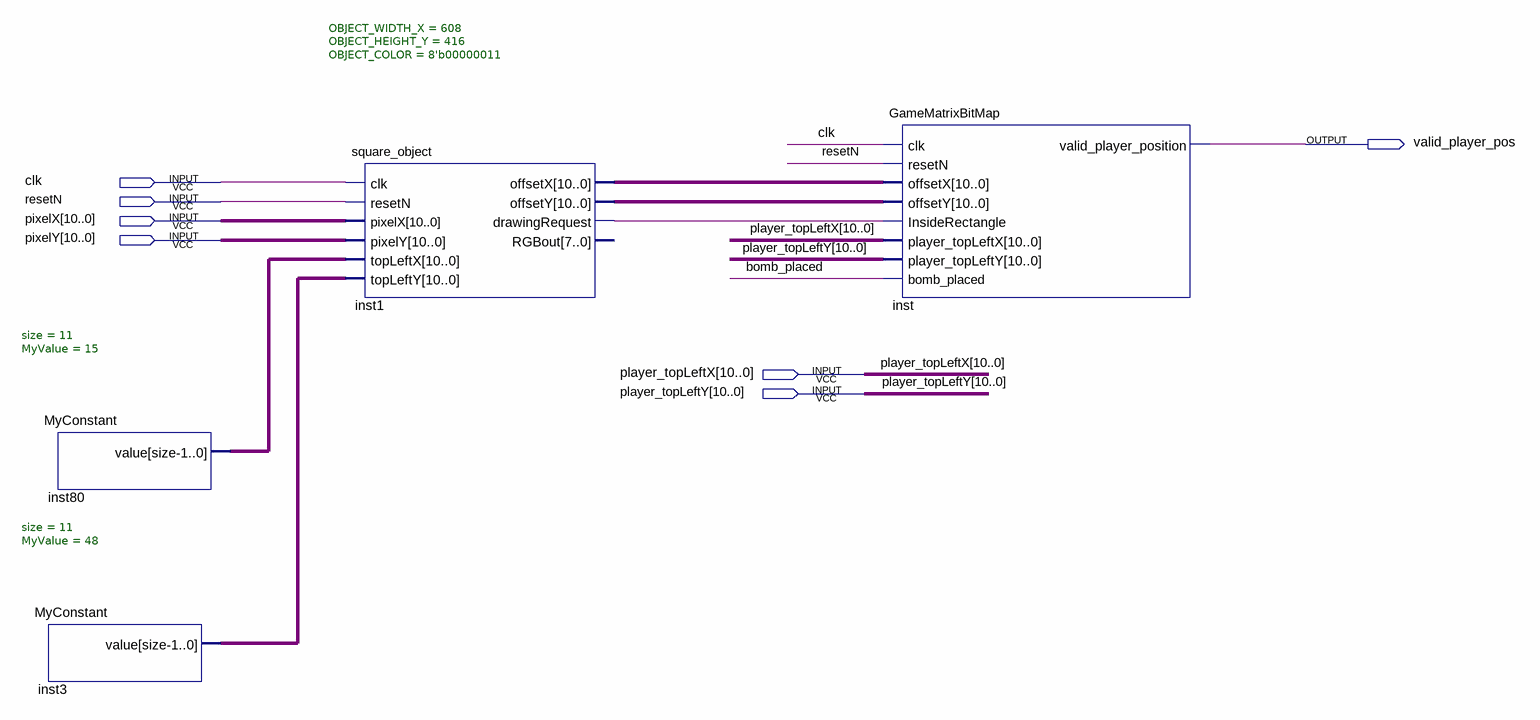
[diagram p0: schematic sheet]
// Quartus schematic Matrix_Block.bdf as structural Verilog: 4 symbols, 7 pins
module Matrix_Block (
  input  clk,
  input  resetN,
  input  [10:0] pixelX,
  input  [10:0] pixelY,
  input  [10:0] player_topLeftX,
  input  [10:0] player_topLeftY,
  output valid_player_pos
);

  wire bomb_placed, inst1_drawingrequest;
  wire [10:0] inst1_offsetx, inst1_offsety, inst3_value, inst80_value;

  MyConstant #(.size(11), .MyValue(15)) inst80 (.value(inst80_value));
  MyConstant #(.size(11), .MyValue(48)) inst3 (.value(inst3_value));
  square_object #(.OBJECT_WIDTH_X(608), .OBJECT_HEIGHT_Y(416), .OBJECT_COLOR(8'b00000011)) inst1 (
    .clk(clk), .resetN(resetN), .pixelX(pixelX), .pixelY(pixelY), .topLeftX(inst80_value),
    .topLeftY(inst3_value), .offsetX(inst1_offsetx), .offsetY(inst1_offsety),
    .drawingRequest(inst1_drawingrequest));  // open: RGBout
  GameMatrixBitMap inst (
    .clk(clk), .resetN(resetN), .offsetX(inst1_offsetx), .offsetY(inst1_offsety),
    .InsideRectangle(inst1_drawingrequest), .player_topLeftX(player_topLeftX),
    .player_topLeftY(player_topLeftY), .bomb_placed(bomb_placed), .valid_player_position(valid_player_pos));
endmodule
